# Altium schematic sheet IRsensor_Relay_Controller.SchDoc
size A; SheetNumber: 1; SheetTotal: 1
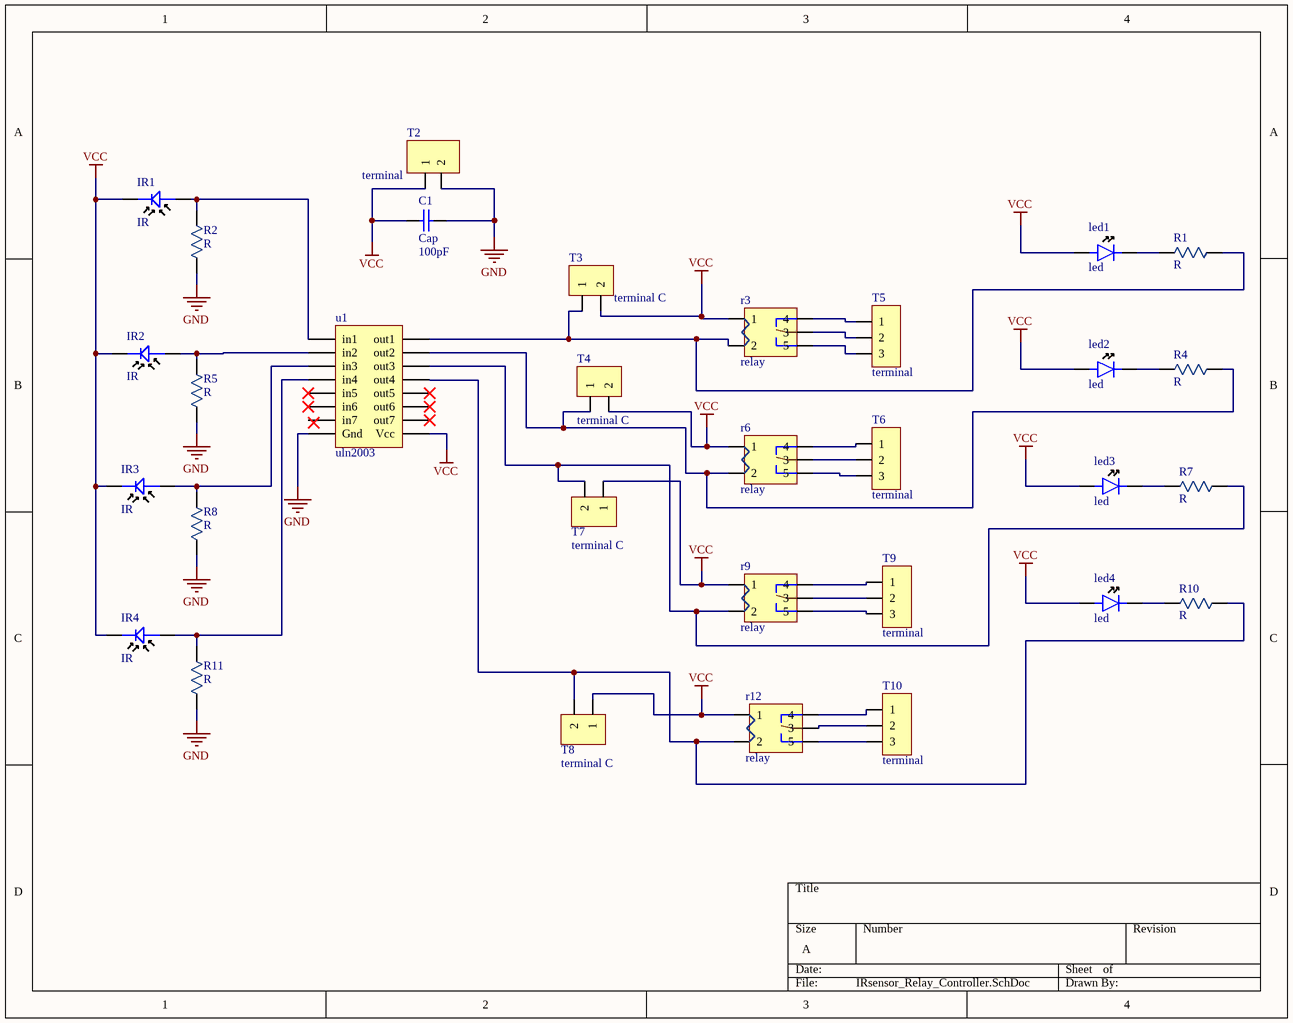
[diagram p0: IRsensor_Relay_Controller.SchDoc]

## Parts
C1  Cap  value 100pF  [RAD-0.3]
IR1  IR  [IR sensor]
IR2  IR  [IR sensor]
IR3  IR  [IR sensor]
IR4  IR  [IR sensor]
led1  led  [led]
led2  led  [led]
led3  led  [led]
led4  led  [led]
R1  R  [resistor 1/4 watt]
R2  R  [resistor 1/4 watt]
r3  relay  [relay 5vdc]
R4  R  [resistor 1/4 watt]
R5  R  [resistor 1/4 watt]
r6  relay  [relay 5vdc]
R7  R  [resistor 1/4 watt]
R8  R  [resistor 1/4 watt]
r9  relay  [relay 5vdc]
R10  R  [resistor 1/4 watt]
R11  R  [resistor 1/4 watt]
r12  relay  [relay 5vdc]
T2  terminal  [terminal 2pin]
T3  terminal C  [terminal C 2pin]
T4  terminal C  [terminal C 2pin]
T5  terminal  [terminal 3pin]
T6  terminal  [terminal 3pin]
T7  terminal C  [terminal C 2pin]
T8  terminal C  [terminal C 2pin]
T9  terminal  [terminal 3pin]
T10  terminal  [terminal 3pin]
u1  uln2003  [uln2003]

## Nets
GND: C1.2 R2.2 R5.2 R8.2 R11.2 T2.2 u1.Vcc(Gnd)
VCC: C1.1 IR1.- IR2.- IR3.- IR4.- led1.+ led2.+ led3.+ led4.+ r3.1 r6.1 r9.1 r12.1 T2.1 T3.2 T4.2 T7.1 T8.1 u1.Vcc
NetIR1_+: IR1.+ R2.1 u1.in1
NetIR2_+: IR2.+ R5.1 u1.in2
NetIR3_+: IR3.+ R8.1 u1.in3
NetIR4_+: IR4.+ R11.1 u1.in4
Netled1_-: led1.- R1.1
Netled2_-: led2.- R4.1
Netled3_-: led3.- R7.1
Netled4_-: led4.- R10.1
NetR1_2: R1.2 r3.2 T3.1 u1.out1
Netr3_3: r3.3 T5.2
Netr3_4: r3.4 T5.1
Netr3_5: r3.5 T5.3
NetR4_2: R4.2 r6.2 T4.1 u1.out2
Netr6_3: r6.3 T6.2
Netr6_4: r6.4 T6.1
Netr6_5: r6.5 T6.3
NetR7_2: R7.2 r9.2 T7.2 u1.out3
Netr9_3: r9.3 T9.2
Netr9_4: r9.4 T9.1
Netr9_5: r9.5 T9.3
NetR10_2: R10.2 r12.2 T8.2 u1.out4
Netr12_3: r12.3 T10.2
Netr12_4: r12.4 T10.1
Netr12_5: r12.5 T10.3

Not connected (* = marked no-connect by the designer): u1 in5* in6* in7 out5* out6* out7*

## Library data of the parts
C1 = Cap: Capacitor; Published: 8-Jun-2000; LatestRevisionDate: 17-Jul-2002; LatestRevisionNote: Re-released for DXP Platform.; PackageReference: RAD-0.3; Publisher: Altium Limited; PackageDescription: Radial Cap, Thru-Hole; 2 Leads; 0.3 in Pin Spacing
IR1-IR4 = IR204-A: EMITTER IR 940NM 100MA RADIAL; Manufacturer: Everlight; Forward Voltage: 4V; Viewing Angle: 35°; Power Dissipation: 150mW; Number of Elements: 1; Lens Style: Circular; Reverse Voltage: 5V; Supplier 1: Future Electronics; Manufacturer Part Number: IR204-A; RoHS: Yes; Category: LEDs; Stock 1: 21000; Pricing 1: 1000=0.07200, 4000=0.04950, 10000=0.04750, 25000=0.04560, 40000=0.04460 (USD); Mount: Through Hole; Case/Package: Radial; Number of Pins: 2; Min Operating Temperature: -40°C; Max Operating Temperature: 85°C; Forward Current: 100mA; Wavelength: 940nm; Package Quantity: 1000; Packaging: Bulk; Test Current: 100mA; Orientation: Top View; Number of LEDs: 1; Series: -; Length: 4mm; Depth: 4mm; Radiation Hardening: No; RoHS Compliant: Yes; Lead Free: Lead Free; ComponentLink1URL: https://datasheet.ciiva.com/4256/743ir204a-4256867.pdf?src-supplier=Arrow+Electronics; ComponentLink1Description: https://datasheet.ciiva.com/4256/743ir204a-4256867.pdf?src-supplier=Arrow+Electronics; ComponentLink2URL: https://datasheet.ciiva.com/26901/getdatasheetpartid-554119-26901401.pdf?src-supplier=Verical; ComponentLink2Description: https://datasheet.ciiva.com/26901/getdatasheetpartid-554119-26901401.pdf?src-supplier=Verical; ComponentLink3URL: https://datasheet.ciiva.com/2107/201407052050005040-2107715.pdf?src-supplier=Digi-Key; ComponentLink3Description: https://datasheet.ciiva.com/2107/201407052050005040-2107715.pdf?src-supplier=Digi-Key; Supplier Part Number 1: 7000312
led1-led4 = led: LED,  5MM,  HIGH EFFICIENCY,  DIFFUSED,  RED; Manufacturer: Dialight; Manufacturer Part Number: 521-9240F; Luminous Intensity: 6.3mcd; Forward Current: 10mA; Lens Style: Diffused,Tinted,Round,Domed,Dome,Colored; Forward Voltage: 2V; Viewing Angle: 50°; Number of Elements: 1; Power Dissipation: 60mW; Current Rating: 25mA; Supplier 1: Digi-Key; RoHS: Yes; Category: LEDs; Stock 1: 2866; Pricing 1: 1=0.77000, 10=0.50600, 100=0.33500, 1000=0.25866, 2000=0.23373, 5000=0.22050 (USD); Mount: Through Hole; Case/Package: Radial; Number of Pins: 2; Color: Red; Lens Color: Red; Min Operating Temperature: -55°C; Max Operating Temperature: 100°C; Packaging: Bulk; Illumination Color: Red; Test Current: 10mA; Lens Transparency: Diffused; Number of LEDs: 1; Series: 521; Height: 8.94mm; Lens Size: 5mm; Radiation Hardening: No; REACH SVHC: No SVHC; RoHS Compliant: Yes; ComponentLink1URL: https://datasheet.ciiva.com/15974/5219240f-15974474.pdf?src-supplier=Onlinecomponents.com; ComponentLink1Description: https://datasheet.ciiva.com/15974/5219240f-15974474.pdf?src-supplier=Onlinecomponents.com; ComponentLink2URL: https://datasheet.ciiva.com/6350/521-9240f-web-6350299.pdf?src-supplier=Digi-Key; ComponentLink2Description: https://datasheet.ciiva.com/6350/521-9240f-web-6350299.pdf?src-supplier=Digi-Key; ComponentLink3URL: https://datasheet.ciiva.com/15209/getdatasheetpartid-245795-15209671.pdf?src-supplier=Verical; ComponentLink3Description: https://datasheet.ciiva.com/15209/getdatasheetpartid-245795-15209671.pdf?src-supplier=Verical; Supplier Part Number 1: 350-2676-ND
R1 R2 R4 R5 R7 R8 R10 R11 = resistor 1/4 watt: RES 330 OHM 1/4W 5% AXIAL; Manufacturer: TE Connectivity; Manufacturer Part Number: CBT25J330R; Resistance: 330R; Power Rating: 250mW; Temperature Coefficient: 400ppm/°C; Insulation Resistance: 1GR; Voltage Rating: 250V; Number of Resistors: 1; Lead Length: 27mm; Lead Diameter: 0.6mm; Supplier 1: Digi-Key; RoHS: Yes; Category: Through-Hole Resistors; Stock 1: 3829; Pricing 1: 1=0.65000, 10=0.46400, 25=0.36200, 50=0.30620, 100=0.24120, 250=0.20408, 500=0.16698, 1000=0.12988 (USD); Mount: Axial; Min Operating Temperature: -55°C; Max Operating Temperature: 125°C; Tolerance: 5%; Packaging: Tape and Reel; Resistor Type: Power resistor; Termination: Axial; Number of Terminations: 2; Series: CBT, Neohm; Max Power Dissipation: 250mW; Resistance Tolerance: 5%; Technology: CARBON COMPOSITION; Diameter: 2.4mm; Length: 6.3mm; ELV: Compliant; RoHS Compliant: Yes; REACH SVHC: Unknown; ComponentLink1URL: https://datasheet.ciiva.com/7657/39351-7657213.pdf?src-supplier=Element14; ComponentLink1Description: https://datasheet.ciiva.com/7657/39351-7657213.pdf?src-supplier=Element14; Supplier Part Number 1: A105936CT-ND
r3 r6 r9 r12 = relay 5v: TE CONNECTIVITY         V23101-D0007-A201             Signal Relay, W11/V23101 Series, SPDT, 24 VDC, 1.25 A, Through Hole, Non Latching; Contact Current Rating: 1.25A; Coil Resistance: 1.28kR; Coil Power: 450mW; Coil Voltage (DC): 24V; Coil Type: Non-Latching; Supplier 1: Newark; Manufacturer: TE Connectivity; Manufacturer Part Number: V23101-D0007-A201; RoHS: No; Category: Relays; Stock 1: 78; Pricing 1: 1=3.98000, 10=3.75000, 25=3.54000, 50=3.33000, 100=3.13000, 500=2.54000 (USD); Contact Material: Silver; Throw Configuration: SPDT; Width: 10.6mm; Height: 15.6mm; REACH SVHC: Unknown; RoHS Compliant: No; ComponentLink1URL: https://datasheet.ciiva.com/6764/13765-6764705.pdf?src-supplier=Newark; ComponentLink1Description: https://datasheet.ciiva.com/6764/13765-6764705.pdf?src-supplier=Newark; ComponentLink2URL: https://datasheet.ciiva.com/1525/1717880-1525156.pdf?src-supplier=Element14; ComponentLink2Description: https://datasheet.ciiva.com/1525/1717880-1525156.pdf?src-supplier=Element14; Supplier Part Number 1: 24M9081
T2 = terminal 2pin: PCB Terminal Block 3 Poles, 5 mm Pitch, 691101710003, Würth Elektronik; Manufacturer: Wurth Electronics; Color: Blue; Plating: Steel; Number of Contacts: 3; Voltage Rating: 250V; Current Rating: 16A; Number of Levels: 1; Pitch: 0.197inch; Wire Gauge (Max): 26AWG; Wire Gauge (Min): 14AWG; Stripping Length: -7mm; Supplier 1: Digi-Key; Manufacturer Part Number: 691101710003; RoHS: Yes; Category: Terminal Blocks; Stock 1: 1007; Pricing 1: 1=0.96000, 10=0.86200, 50=0.74500, 100=0.69120 (USD); Mount: Through Hole; Contact Plating: Tin; Contact Material: Brass; Housing Material: PA66; Min Operating Temperature: -40°C; Max Operating Temperature: 105°C; Packaging: Bulk; Termination: Screw; Package Quantity: 400; Number of Positions Per Level: 3; Current: 16A; Voltage: 250V; Series: WR-TBL Series 101; Length: 9mm; Width: 16.2mm; Height: 16.4mm; Wire/Cable Gauge: 26AWG; RoHS Compliant: Yes; REACH SVHC: Unknown; ComponentLink1URL: https://datasheet.ciiva.com/824/6911017100xx-824072.pdf?src-supplier=Digi-Key; ComponentLink1Description: https://datasheet.ciiva.com/824/6911017100xx-824072.pdf?src-supplier=Digi-Key; Supplier Part Number 1: 732-2027-ND
T3 T4 T7 T8 = terminal Cu: .100 TERMINAL ASSEMBLY; Manufacturer: Samtec; Manufacturer Part Number: IPL1-102-01-S-S-RA-K; Number of Terminals/Pins: 2; Number of Ports: 1; Gender: Male; Max Current Rating: 7.4A; Max Voltage Rating (AC): 675V; Pitch: 2.54mm; Supplier 1: Digi-Key; RoHS: Yes; Category: Headers and Wire Housings; Stock 1: 73; Pricing 1: 1=5.56000, 10=5.05300, 80=4.45200, 440=3.78420, 945=3.22770 (USD); Mount: Through Hole; Contact Material: Bronze; Contact Plating: Gold; Housing Material: Polymer; Min Operating Temperature: -55°C; Max Operating Temperature: 125°C; Packaging: Bulk; Termination: Solder; Number of Contacts: 2; Orientation: Right Angle; Length: 6.6mm; Depth: 9.65mm; Radiation Hardening: No; RoHS Compliant: Yes; ComponentLink1URL: https://datasheet.ciiva.com/9446/ipl1-9446232.pdf?src-supplier=Avnet; ComponentLink1Description: https://datasheet.ciiva.com/9446/ipl1-9446232.pdf?src-supplier=Avnet; ComponentLink2URL: https://datasheet.ciiva.com/16677/ipl1-16677866.pdf?src-supplier=Avnet+Europe; ComponentLink2Description: https://datasheet.ciiva.com/16677/ipl1-16677866.pdf?src-supplier=Avnet+Europe; Supplier Part Number 1: SAM12667-ND
T5 T6 T9 T10 = terminal 3pin: Conn Mini-Power Terminal Strip HDR 12 POS 2.54mm Solder ST SMD 12 Terminal 1 Port; Manufacturer: Samtec; Manufacturer Part Number: IPL1-106-02-L-D-K; Number of Terminals/Pins: 12; Color: Natural; Number of Ports: 1; Gender: Male; Max Current Rating: 7.4A; Max Voltage Rating (AC): 675V; Connector Type: Male Pin; Row Spacing: 0.1inch; Supplier 1: Digi-Key; RoHS: Yes; Category: Headers and Wire Housings; Stock 1: 86; Pricing 1: 1=5.43000, 34=4.67294, 102=4.34696, 442=3.69495, 952=3.15158 (USD); Mount: Surface Mount; Contact Material: Bronze; Contact Plating: Gold; Housing Material: Polymer; Min Operating Temperature: -55°C; Max Operating Temperature: 125°C; Packaging: Rail/Tube; Termination: Solder; Number of Contacts: 12; Orientation: Straight; Package Quantity: 1; Number of Rows: 2; Number of Positions: 12; Series: Mini Mate® IPL1; Fastening Type: Ramp; Contact Type: Male Pin; Length: 16.76mm; Pitch: 2.54mm; Depth: 9.58mm; Contact Mating Length: 0.215inch; Radiation Hardening: No; RoHS Compliant: Yes; ComponentLink1URL: https://datasheet.ciiva.com/9444/ipl1-9444382.pdf?src-supplier=Avnet; ComponentLink1Description: https://datasheet.ciiva.com/9444/ipl1-9444382.pdf?src-supplier=Avnet; ComponentLink2URL: https://datasheet.ciiva.com/16677/ipl1-16677742.pdf?src-supplier=Avnet+Europe; ComponentLink2Description: https://datasheet.ciiva.com/16677/ipl1-16677742.pdf?src-supplier=Avnet+Europe; ComponentLink3URL: https://datasheet.ciiva.com/739/ipl1-1xx-xx-xxx-d-xx-x-mkt-739359.pdf?src-supplier=Digi-Key; ComponentLink3Description: https://datasheet.ciiva.com/739/ipl1-1xx-xx-xxx-d-xx-x-mkt-739359.pdf?src-supplier=Digi-Key; Supplier Part Number 1: SAM10584-ND
u1 = ULN2003ADR: TEXAS INSTRUMENTS - ULN2003ADR - Bipolar Transistor Array, Darlington, NPN, 50 V, 350 mA, SOIC; Collector Emitter Voltage (VCEO): 50V; Max Collector Current: 500mA; Collector Emitter Saturation Voltage: 1.1V; Number of Elements: 7; Supplier 1: Digi-Key; Manufacturer: Texas Instruments; Manufacturer Part Number: ULN2003ADR; RoHS: Yes; Category: Interface ICs; Pricing 1: 1=0.56000, 10=0.47700, 25=0.44520, 100=0.35620, 500=0.27984, 1000=0.21624 (USD); Mount: Surface Mount; Case/Package: SOIC; Number of Pins: 16; Contact Plating: Gold; Weight: 0.004998oz; Min Operating Temperature: -20°C; Max Operating Temperature: 70°C; Package Quantity: 1; Packaging: Tape and Reel; Polarity: NPN; Number of Drivers: 7; Collector Emitter Breakdown Voltage: 50V; Voltage Rating (DC): 50V; Current Rating: 500mA; Length: 9.9mm; Width: 3.91mm; Height: 1.58mm; Radiation Hardening: No; Lead Free: Lead Free; REACH SVHC: No SVHC; RoHS Compliant: Yes; ComponentLink1URL: https://datasheet.ciiva.com/27049/700605-27049624.pdf?src-supplier=Jameco; ComponentLink1Description: https://datasheet.ciiva.com/27049/700605-27049624.pdf?src-supplier=Jameco; ComponentLink2URL: https://datasheet.ciiva.com/15139/getdatasheetpartid-40508-15139849.pdf?src-supplier=Verical; ComponentLink2Description: https://datasheet.ciiva.com/15139/getdatasheetpartid-40508-15139849.pdf?src-supplier=Verical; ComponentLink3URL: https://datasheet.ciiva.com/1700/uln2003a-1700766.pdf?src-supplier=Digi-Key; ComponentLink3Description: https://datasheet.ciiva.com/1700/uln2003a-1700766.pdf?src-supplier=Digi-Key; ComponentLink4URL: https://datasheet.ciiva.com/1700/uln2003a-1700767.pdf?src-supplier=Digi-Key; ComponentLink4Description: https://datasheet.ciiva.com/1700/uln2003a-1700767.pdf?src-supplier=Digi-Key; ComponentLink5URL: https://datasheet.ciiva.com/1700/uln2003a-1700768.pdf?src-supplier=Digi-Key; ComponentLink5Description: https://datasheet.ciiva.com/1700/uln2003a-1700768.pdf?src-supplier=Digi-Key; ComponentLink6URL: https://datasheet.ciiva.com/14424/ulq2003a-14424060.pdf?src-supplier=Avnet; ComponentLink6Description: https://datasheet.ciiva.com/14424/ulq2003a-14424060.pdf?src-supplier=Avnet; ComponentLink7URL: https://datasheet.ciiva.com/14424/ulq2003a-14424061.pdf?src-supplier=Avnet; ComponentLink7Description: https://datasheet.ciiva.com/14424/ulq2003a-14424061.pdf?src-supplier=Avnet; ComponentLink8URL: https://datasheet.ciiva.com/46423/1831474-46423371.pdf?src-supplier=Element14; ComponentLink8Description: https://datasheet.ciiva.com/46423/1831474-46423371.pdf?src-supplier=Element14; ComponentLink9URL: https://datasheet.ciiva.com/26229/ulq2003a-26229797.pdf?src-supplier=Avnet+Europe; ComponentLink9Description: https://datasheet.ciiva.com/26229/ulq2003a-26229797.pdf?src-supplier=Avnet+Europe; ComponentLink10URL: https://datasheet.ciiva.com/1193/1851982-1193407.pdf?src-supplier=Element14; ComponentLink10Description: https://datasheet.ciiva.com/1193/1851982-1193407.pdf?src-supplier=Element14; Supplier Part Number 1: 296-1368-1-ND